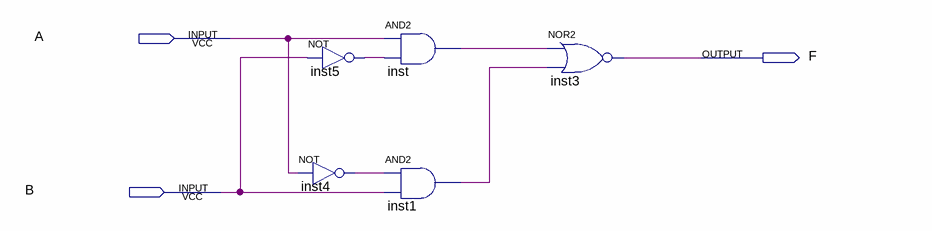
[diagram p0: schematic sheet]
// Quartus schematic YHM.bdf as structural Verilog: 5 symbols, 3 pins
module YHM (
  input  A,
  input  B,
  output F
);

  wire inst1_out, inst4_out, inst5_out, inst_out;

  not inst5 (inst5_out, B);
  not inst4 (inst4_out, A);
  and inst (inst_out, A, inst5_out);
  and inst1 (inst1_out, inst4_out, B);
  nor inst3 (F, inst_out, inst1_out);
endmodule
